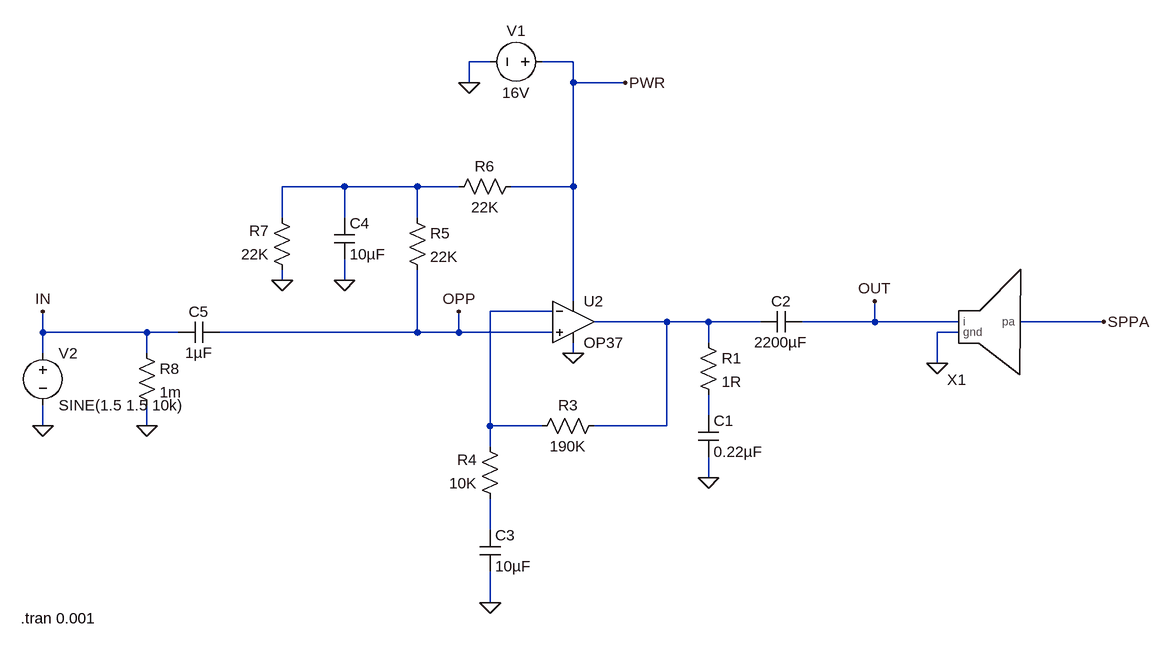
[diagram p0: schematic audio.asc]
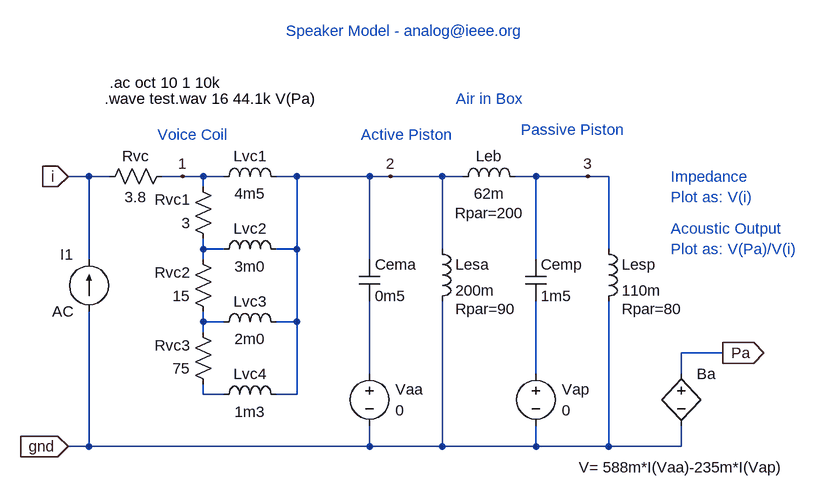
[diagram p1: sub-circuit speaker.asc]
audio.asc, the LTspice schematic file:
Version 4
SHEET 1 1100 680
WIRE 64 -240 32 -240
WIRE 192 -240 144 -240
WIRE 32 -208 32 -240
WIRE 192 -208 192 -240
WIRE 272 -208 192 -208
WIRE -160 -48 -256 -48
WIRE -48 -48 -160 -48
WIRE 16 -48 -48 -48
WIRE 192 -48 192 -208
WIRE 192 -48 96 -48
WIRE -256 0 -256 -48
WIRE -160 0 -160 -48
WIRE -48 0 -48 -48
WIRE -256 96 -256 80
WIRE -160 96 -160 64
WIRE 192 128 192 -48
WIRE 160 144 64 144
WIRE 336 160 224 160
WIRE 400 160 336 160
WIRE 480 160 400 160
WIRE 656 160 656 128
WIRE 656 160 544 160
WIRE 784 160 656 160
WIRE 1008 160 880 160
WIRE -624 176 -624 144
WIRE -464 176 -624 176
WIRE -416 176 -464 176
WIRE -48 176 -48 80
WIRE -48 176 -352 176
WIRE 16 176 16 144
WIRE 16 176 -48 176
WIRE 160 176 16 176
WIRE 784 176 752 176
WIRE 400 192 400 160
WIRE -624 208 -624 176
WIRE -464 208 -464 176
WIRE 192 208 192 192
WIRE 752 224 752 176
WIRE 400 304 400 272
WIRE -624 320 -624 288
WIRE -464 320 -464 288
WIRE 64 320 64 144
WIRE 144 320 64 320
WIRE 336 320 336 160
WIRE 336 320 224 320
WIRE 64 352 64 320
WIRE 400 400 400 368
WIRE 64 480 64 432
WIRE 64 592 64 544
FLAG 192 208 0
FLAG 400 400 0
FLAG 752 224 0
FLAG 64 592 0
FLAG -464 320 0
FLAG -256 96 0
FLAG -160 96 0
FLAG 32 -208 0
FLAG -624 320 0
FLAG -624 144 IN
FLAG 656 128 OUT
FLAG 16 144 OPP
FLAG 272 -208 PWR
FLAG 1008 160 SPPA
SYMBOL res 384 176 R0
SYMATTR InstName R1
SYMATTR Value 1R
SYMBOL cap 384 304 R0
SYMATTR InstName C1
SYMATTR Value 0.22µF
SYMBOL cap 544 144 R90
WINDOW 0 0 32 VBottom 2
WINDOW 3 32 32 VTop 2
SYMATTR InstName C2
SYMATTR Value 2200µF
SYMBOL res 240 304 R90
WINDOW 0 0 56 VBottom 2
WINDOW 3 32 56 VTop 2
SYMATTR InstName R3
SYMATTR Value 190K
SYMBOL res 80 448 R180
WINDOW 0 36 76 Left 2
WINDOW 3 36 40 Left 2
SYMATTR InstName R4
SYMATTR Value 10K
SYMBOL cap 48 480 R0
SYMATTR InstName C3
SYMATTR Value 10µF
SYMBOL res -64 -16 R0
SYMATTR InstName R5
SYMATTR Value 22K
SYMBOL res 112 -64 R90
WINDOW 0 0 56 VBottom 2
WINDOW 3 32 56 VTop 2
SYMATTR InstName R6
SYMATTR Value 22K
SYMBOL res -240 96 R180
WINDOW 0 36 76 Left 2
WINDOW 3 36 40 Left 2
SYMATTR InstName R7
SYMATTR Value 22K
SYMBOL cap -176 0 R0
SYMATTR InstName C4
SYMATTR Value 10µF
SYMBOL cap -352 160 R90
WINDOW 0 0 32 VBottom 2
WINDOW 3 32 32 VTop 2
SYMATTR InstName C5
SYMATTR Value 1µF
SYMBOL res -480 192 R0
SYMATTR InstName R8
SYMATTR Value 1m
SYMBOL voltage 160 -240 R90
WINDOW 0 -32 56 VBottom 2
WINDOW 3 32 56 VTop 2
WINDOW 123 0 0 Left 2
WINDOW 39 0 0 Left 2
SYMATTR InstName V1
SYMATTR Value 16V
SYMBOL voltage -624 192 R0
WINDOW 123 0 0 Left 2
WINDOW 39 0 0 Left 2
SYMATTR InstName V2
SYMATTR Value SINE(1.5 1.5 10k)
SYMBOL Opamps\\OP37 192 96 R0
SYMATTR InstName U2
SYMBOL speaker 816 160 R0
SYMATTR InstName X1
TEXT -658 616 Left 2 !.tran 0.001

speaker.asc, the sub-circuit schematic file:
Version 4
SHEET 1 1536 680
WIRE -416 -48 -448 -48
WIRE -384 -48 -416 -48
WIRE -272 -48 -304 -48
WIRE -240 -48 -272 -48
WIRE -208 -48 -240 -48
WIRE -96 -48 -128 -48
WIRE 16 -48 -96 -48
WIRE 48 -48 16 -48
WIRE 128 -48 48 -48
WIRE 160 -48 128 -48
WIRE 272 -48 240 -48
WIRE 352 -48 272 -48
WIRE 384 -48 352 -48
WIRE -240 -32 -240 -48
WIRE -240 64 -240 48
WIRE -208 64 -240 64
WIRE -96 64 -96 -48
WIRE -96 64 -128 64
WIRE 128 64 128 -48
WIRE 384 64 384 -48
WIRE -416 80 -416 -48
WIRE -240 80 -240 64
WIRE 16 80 16 -48
WIRE 272 80 272 -48
WIRE -240 176 -240 160
WIRE -208 176 -240 176
WIRE -96 176 -96 64
WIRE -96 176 -128 176
WIRE -240 192 -240 176
WIRE 560 224 496 224
WIRE 16 256 16 144
WIRE 272 256 272 144
WIRE 496 256 496 224
WIRE -240 288 -240 272
WIRE -208 288 -240 288
WIRE -96 288 -96 176
WIRE -96 288 -128 288
WIRE -416 368 -416 160
WIRE -416 368 -448 368
WIRE 16 368 16 336
WIRE 16 368 -416 368
WIRE 128 368 128 144
WIRE 128 368 16 368
WIRE 272 368 272 336
WIRE 272 368 128 368
WIRE 384 368 384 144
WIRE 384 368 272 368
WIRE 496 368 496 336
WIRE 496 368 384 368
FLAG 560 224 Pa
IOPIN 560 224 Out
FLAG -448 -48 i
IOPIN -448 -48 In
FLAG -272 -48 1
FLAG 48 -48 2
FLAG 352 -48 3
FLAG -448 368 gnd
IOPIN -448 368 In
SYMBOL res -224 64 R180
WINDOW 0 36 76 Left 2
WINDOW 3 36 40 Left 2
SYMATTR InstName Rvc1
SYMATTR Value 3
SYMBOL res -224 176 R180
WINDOW 0 36 76 Left 2
WINDOW 3 36 40 Left 2
SYMATTR InstName Rvc2
SYMATTR Value 15
SYMBOL res -224 288 R180
WINDOW 0 36 76 Left 2
WINDOW 3 36 40 Left 2
SYMATTR InstName Rvc3
SYMATTR Value 75
SYMBOL res -288 -64 R90
WINDOW 0 0 56 VBottom 2
WINDOW 3 32 56 VTop 2
SYMATTR InstName Rvc
SYMATTR Value 3.8
SYMBOL ind -224 -32 R270
WINDOW 0 32 56 VTop 2
WINDOW 3 5 56 VBottom 2
SYMATTR InstName Lvc1
SYMATTR Value 4m5
SYMBOL ind -224 80 R270
WINDOW 0 32 56 VTop 2
WINDOW 3 5 56 VBottom 2
SYMATTR InstName Lvc2
SYMATTR Value 3m0
SYMBOL ind -224 192 R270
WINDOW 0 32 56 VTop 2
WINDOW 3 5 56 VBottom 2
SYMATTR InstName Lvc3
SYMATTR Value 2m0
SYMBOL ind 144 -32 R270
WINDOW 0 32 56 VTop 2
WINDOW 3 5 56 VBottom 2
WINDOW 39 -25 57 VBottom 2
SYMATTR InstName Leb
SYMATTR Value 62m
SYMATTR SpiceLine Rpar=200
SYMBOL cap 0 80 R0
SYMATTR InstName Cema
SYMATTR Value 0m5
SYMBOL ind 112 48 R0
WINDOW 39 36 108 Left 2
SYMATTR SpiceLine Rpar=90
SYMATTR InstName Lesa
SYMATTR Value 200m
SYMBOL ind 368 48 R0
WINDOW 39 36 108 Left 2
SYMATTR SpiceLine Rpar=80
SYMATTR InstName Lesp
SYMATTR Value 110m
SYMBOL cap 256 80 R0
SYMATTR InstName Cemp
SYMATTR Value 1m5
SYMBOL ind -224 304 R270
WINDOW 0 32 56 VTop 2
WINDOW 3 5 56 VBottom 2
SYMATTR InstName Lvc4
SYMATTR Value 1m3
SYMBOL voltage 16 240 R0
WINDOW 0 40 40 Left 2
WINDOW 3 40 72 Left 2
SYMATTR InstName Vaa
SYMATTR Value 0
SYMBOL voltage 272 240 R0
WINDOW 0 40 40 Left 2
WINDOW 3 40 72 Left 2
SYMATTR InstName Vap
SYMATTR Value 0
SYMBOL bv 496 240 R0
WINDOW 3 0 160 Center 2
SYMATTR Value V= 588m*I(Vaa)-235m*I(Vap)
SYMATTR InstName Ba
SYMBOL current -416 160 R180
WINDOW 0 24 88 Left 2
WINDOW 3 24 0 Left 2
WINDOW 123 0 0 Left 2
WINDOW 39 0 0 Left 2
SYMATTR InstName I1
SYMATTR Value AC
TEXT 480 64 Left 2 ;Plot as: V(Pa)/V(i)
TEXT 480 32 Left 2 ;Acoustic Output
TEXT -256 -112 Center 2 ;Voice Coil
TEXT 200 -168 Center 2 ;Air in Box
TEXT 328 -120 Center 2 ;Passive Piston
TEXT 72 -112 Center 2 ;Active Piston
TEXT 72 -272 Center 2 ;Speaker Model - analog@ieee.org
TEXT 480 -48 Left 2 ;Impedance
TEXT 480 -16 Left 2 ;Plot as: V(i)
TEXT -384 -192 Left 2 !.ac oct 10 1 10k
TEXT -392 -168 Left 2 !.wave test.wav 16 44.1k V(Pa)

The netlist it stands for:
* audio.asc
R1 N003 N004 1R
C1 N004 0 0.22µF
C2 OUT N003 2200µF
R3 N003 N002 190K
R4 N005 N002 10K
C3 N005 0 10µF
R5 N001 OPP 22K
R6 PWR N001 22K
R7 0 N001 22K
C4 N001 0 10µF
C5 OPP IN 1µF
R8 IN 0 1m
V1 PWR 0 16V
V2 IN 0 SINE(1.5 1.5 10k)
XU2 OPP N002 PWR 0 N003 LT1037  ; OP37, pins In+ In- V+ V- OUT
XX1 OUT 0 SPPA speaker

* block symbol definitions
.subckt speaker i gnd pa
Rvc1 N001 1 3
Rvc2 N002 N001 15
Rvc3 N005 N002 75
Rvc 1 i 3.8
Lvc1 1 2 4m5
Lvc2 N001 2 3m0
Lvc3 N002 2 2m0
Leb 2 3 62m Rpar=200
Cema 2 N003 0m5
Lesa 2 gnd 200m Rpar=90
Lesp 3 gnd 110m Rpar=80
Cemp 3 N004 1m5
Lvc4 N005 2 1m3
Vaa N003 gnd 0
Vap N004 gnd 0
Ba Pa gnd V= 588m*I(Vaa)-235m*I(Vap)
I1 gnd i AC
* Plot as: V(Pa)/V(i)
* Acoustic Output
* Voice Coil
* Air in Box
* Passive Piston
* Active Piston
* Speaker Model - analog@ieee.org
* Impedance
* Plot as: V(i)
.ac oct 10 1 10k
.wave test.wav 16 44.1k V(Pa)
.ends speaker

.tran 0.001
.lib LTC.lib
.backanno
.end